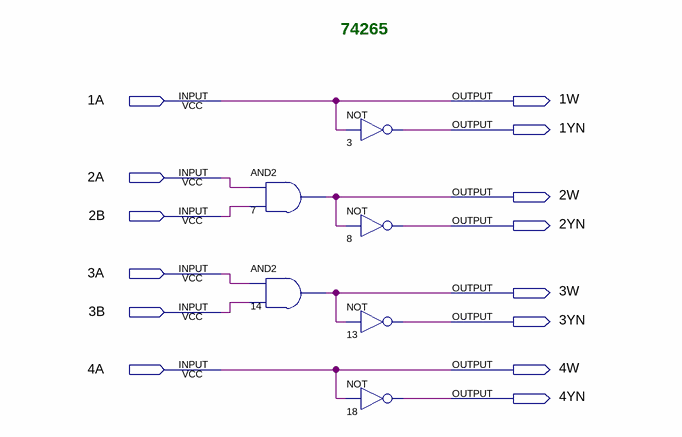
[diagram p0: schematic sheet]
// Quartus schematic 74265.bdf as structural Verilog: 6 symbols, 14 pins
module \74265  (
  input  \1A ,
  input  \2A ,
  input  \2B ,
  input  \3A ,
  input  \3B ,
  input  \4A ,
  output \1W ,
  output \1YN ,
  output \2W ,
  output \2YN ,
  output \3W ,
  output \3YN ,
  output \4W ,
  output \4YN 
);

  and u_7 (\2W , \2A , \2B );
  and u_14 (\3W , \3A , \3B );
  not u_3 (\1YN , \1A );
  not u_8 (\2YN , \2W );
  not u_13 (\3YN , \3W );
  not u_18 (\4YN , \4A );

  assign \1W  = \1A ;
  assign \4W  = \4A ;

  // Notes on the sheet:
  //   74265
endmodule
